# Altium schematic sheet Sensor_Module.SchDoc: Sensor Module
size A4; DocumentNumber: 7; SheetNumber: 7; SheetTotal: 31
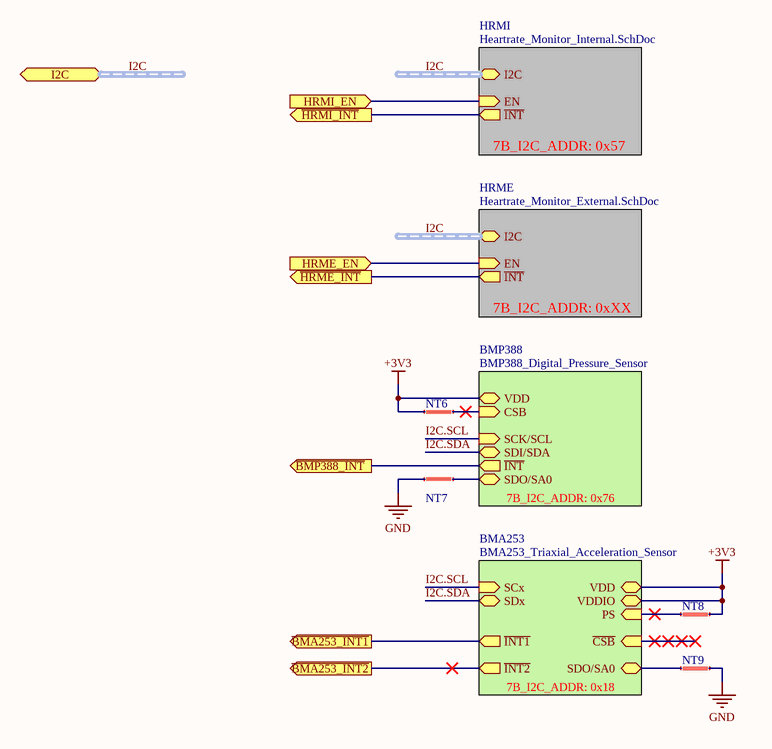
[diagram p0: Sensor_Module.SchDoc]

## Parts
NT6  Net Tie  [Net Tie 6x30mil]  (value not drawn)  (net tie, no BOM)
NT7  Net Tie  [Net Tie 6x30mil]  (value not drawn)  (net tie, no BOM)
NT8  Net Tie  [Net Tie 6x30mil]  (value not drawn)  (net tie, no BOM)
NT9  Net Tie  [Net Tie 6x30mil]  (value not drawn)  (net tie, no BOM)

## Sub-sheets
BMA253 = BMA253_Triaxial_Acceleration_Sensor: ~{INT2} (out), ~{INT1} (out), SCx (in), SDO/SA0, ~{CSB} (in), PS (in), SDx (bidir), VDD, VDDIO  | 7B_I2C_ADDR: 0x18
BMP388 = BMP388_Digital_Pressure_Sensor: VDD, SCK/SCL (in), SDI/SDA (bidir), SDO/SA0 (bidir), CSB (in), ~{INT} (out)  | 7B_I2C_ADDR: 0x76
HRME = Heartrate_Monitor_External.SchDoc: I2C (harness I2C), EN (in), ~{INT} (out)  | 7B_I2C_ADDR: 0xXX
HRMI = Heartrate_Monitor_Internal.SchDoc: I2C (harness I2C), EN (in), ~{INT} (out)  | 7B_I2C_ADDR: 0x57

## Ports
HRME_EN (in), HRMI_EN (in), I2C (harness I2C), ~{BMA253_INT1} (out), ~{BMA253_INT2} (out), ~{BMP388_INT} (out), ~{HRME_INT} (out), ~{HRMI_INT} (out)

## Nets
+3V3: NT6.1 NT8.2 ; sheet BMP388/VDD, sheet BMA253/VDD, sheet BMA253/VDDIO
GND: NT7.2 NT9.2
~{BMA253_INT1}: port ~{BMA253_INT1}, sheet BMA253/~{INT1}
~{BMA253_INT2}: port ~{BMA253_INT2}, sheet BMA253/~{INT2}
~{BMP388_INT}: port ~{BMP388_INT}, sheet BMP388/~{INT}
~{HRME_INT}: port ~{HRME_INT}, sheet HRME/~{INT}
~{HRMI_INT}: port ~{HRMI_INT}, sheet HRMI/~{INT}
HRME_EN: port HRME_EN, sheet HRME/EN
HRMI_EN: port HRMI_EN, sheet HRMI/EN
I2C.SCL: sheet BMP388/SCK/SCL, sheet BMA253/SCx
I2C.SDA: sheet BMP388/SDI/SDA, sheet BMA253/SDx
NetNT6_2: NT6.2 ; sheet BMP388/CSB
NetNT7_1: NT7.1 ; sheet BMP388/SDO/SA0
NetNT8_1: NT8.1 ; sheet BMA253/PS
NetNT9_1: NT9.1 ; sheet BMA253/SDO/SA0

## Buses and harness runs
harness I2C = port I2C
harness I2C = sheet HRME/I2C
harness I2C = sheet HRMI/I2C

## Notes on the sheet
- Title
- Size:
- Date:
- A4
- Number:
- Time:
- Revision:
- Sheet
- of
- File:

## Library data of the parts
NT6-NT9 = Net Tie Line: ClassName: Net Tie